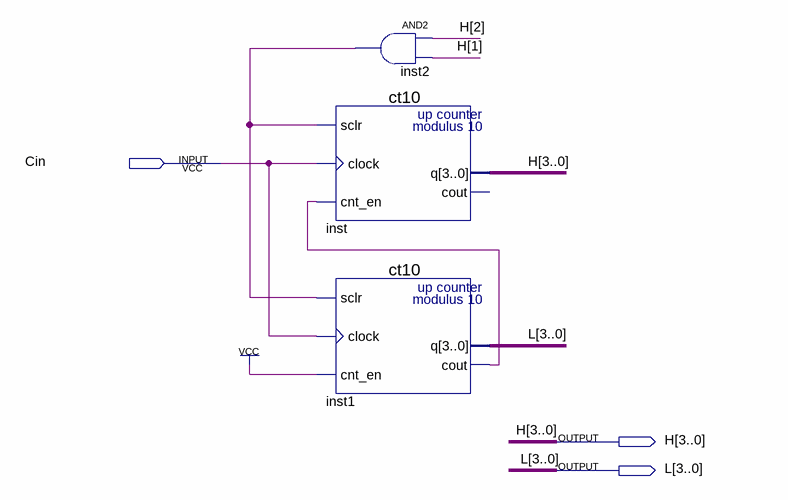
[diagram p0: schematic sheet]
// Quartus schematic timeCounter60.bdf as structural Verilog: 3 symbols, 3 pins
module timeCounter60 (
  input  Cin,
  output [3:0] H,
  output [3:0] L
);

  wire inst1_cout, inst2_out;

  and inst2 (inst2_out, H[2], H[1]);
  ct10 inst (.sclr(inst2_out), .clock(Cin), .cnt_en(inst1_cout), .q(H));  // open: cout
  ct10 inst1 (.sclr(inst2_out), .clock(Cin), .cnt_en(1'b1), .q(L), .cout(inst1_cout));
endmodule
